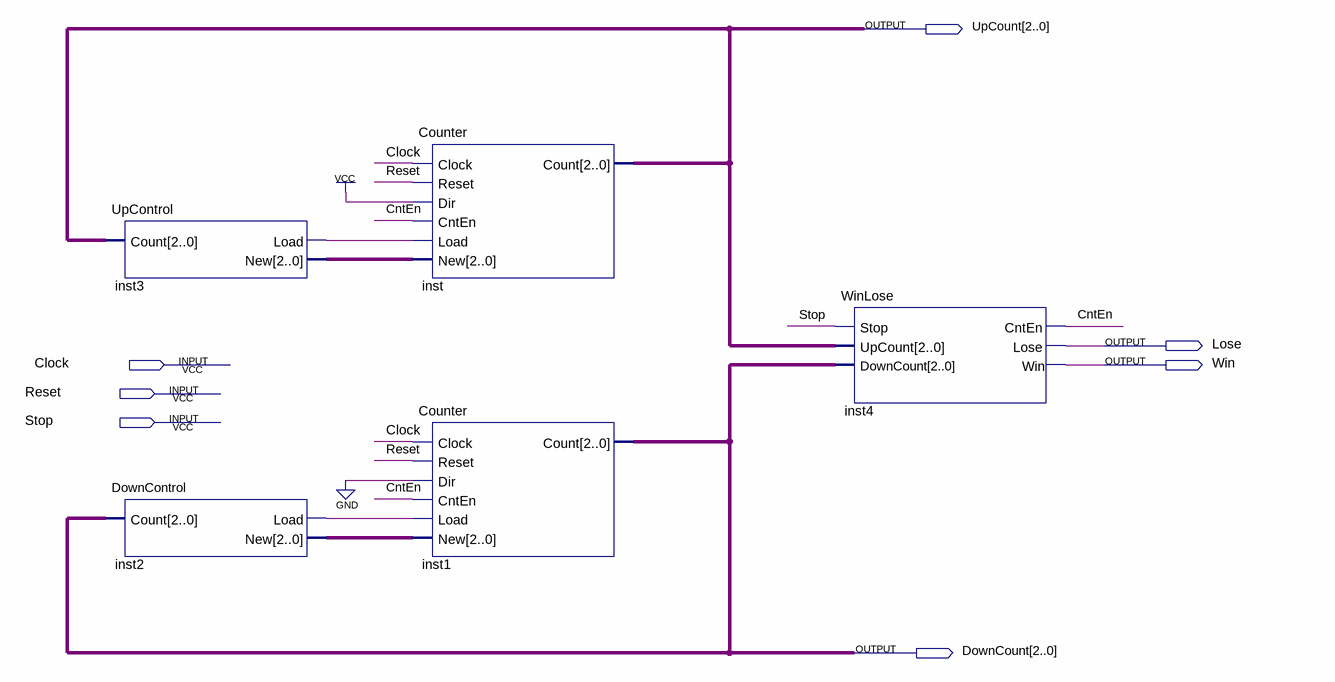
[diagram p0: schematic sheet]
// Quartus schematic Lab7.bdf as structural Verilog: 5 symbols, 7 pins
module Lab7 (
  input  Clock,
  input  Reset,
  input  Stop,
  output [2:0] UpCount,
  output Lose,
  output Win,
  output [2:0] DownCount
);

  wire CntEn, inst2_load, inst3_load;
  wire [2:0] inst2_new, inst3_new;

  UpControl inst3 (.Count(UpCount), .Load(inst3_load), .New(inst3_new));
  DownControl inst2 (.Count(DownCount), .Load(inst2_load), .New(inst2_new));
  Counter inst (
    .Clock(Clock), .Reset(Reset), .Dir(1'b1), .CntEn(CntEn), .Load(inst3_load), .New(inst3_new),
    .Count(UpCount));
  Counter inst1 (
    .Clock(Clock), .Reset(Reset), .Dir(1'b0), .CntEn(CntEn), .Load(inst2_load), .New(inst2_new),
    .Count(DownCount));
  WinLose inst4 (.Stop(Stop), .UpCount(UpCount), .DownCount(DownCount), .CntEn(CntEn), .Lose(Lose), .Win(Win));
endmodule
